# Altium schematic sheet Backflow Current Control Unit (BCCU).SchDoc
size A4; SheetNumber: 8; SheetTotal: 13
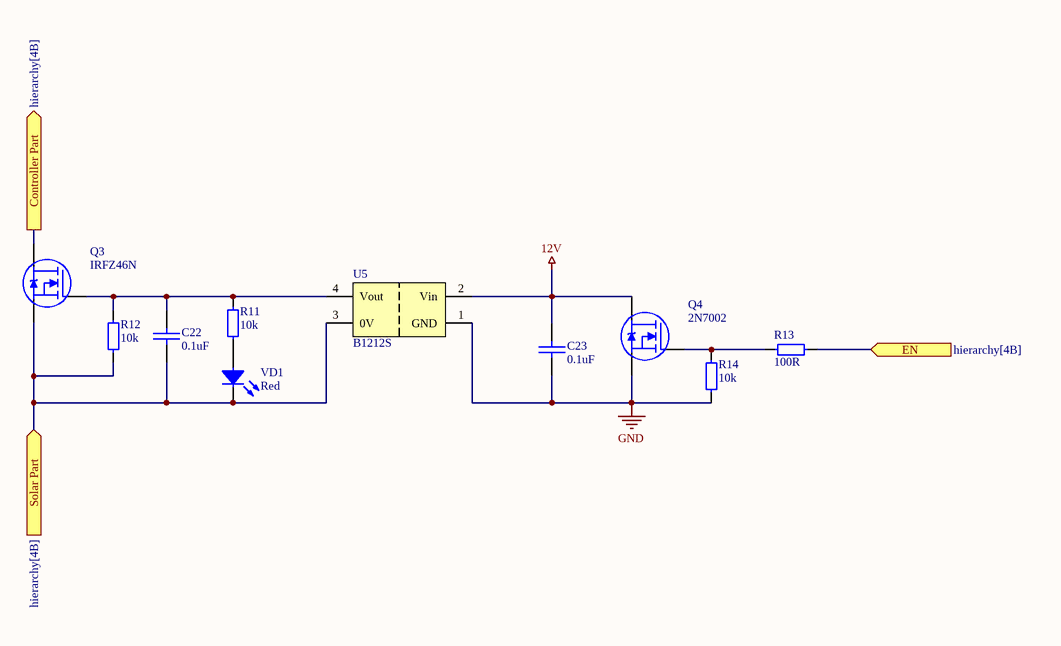
[diagram p0: Backflow Current Control Unit (BCCU).SchDoc]

## Parts
C22  0.1uF  [0805 Capicator]
C23  0.1uF  [0805 Capicator]
Q3  IRFZ46N  [TO220]
Q4  2N7002  [SOT23]
R11  10k  [0805 Resistor]
R12  10k  [0805 Resistor]
R13  100R  [0805 Resistor]
R14  10k  [0805 Resistor]
U5  B1212S  [SIP4]
VD1  Red  [LED: 0805R]

## Ports
Controller Part (out, see hierarchy[4B]), EN (in, see hierarchy[4B]), Solar Part (in, see hierarchy[4B])

## Nets
12V: C23.1 Q4.3(Drain) U5.2(Vin)
GND: C23.2 Q4.2(Source) R14.1 U5.1(GND)
Controller Part: Q3.2(Drain) ; port Controller Part
EN: R13.2 ; port EN
Solar Part: C22.1 Q3.3(Source) R12.2 U5.3(0V) VD1.2 ; port Solar Part
NetC22_2: C22.2 Q3.1(Gate) R11.1 R12.1 U5.4(Vout)
NetQ4_1: Q4.1(Gate) R13.1 R14.2
NetR11_2: R11.2 VD1.1

## Library data of the parts
C22 C23 = Cap 0.1uF (0805): 0.1uF X7R 25V 10% 0805; Manufacturer: Murata Manufacturing; Part Number: GRM21BR71E104KA01L; Type: Capacitor; ComponentLink1Description: Chip&Dip; ComponentLink1URL: https://www.chipdip.ru/product/grm21br71e104ka01l
Q3 = MOSFET-N IRFZ46N: MOSFT 55V 46A 16.5mOhm 48nC; ComponentLink1Description: Buy; ComponentLink1URL: https://radioremont.com/product/tranzistor-irfz46n-k900-11/#/discount-tab/; ComponentLink2Description: Datasheet; ComponentLink2URL: https://www.quartz1.com/price/PIC/415N0072900.pdf
Q4 = MOSFET-N 2N7002: MOSFET-N 60V 0.3A 2Ohm; Type: Transistor; ComponentLink1Description: Buy; ComponentLink1URL: https://radioremont.com/product/tranzistor-2n7002-702-k14-11/#/discount-tab/; ComponentLink2Description: Datasheet; ComponentLink2URL: https://assets.nexperia.com/documents/data-sheet/2N7002.pdf
R11 R12 R14 = Res 10k (0805): 0.125W 0805 10k, 1%; Part Number: RC0805FR-0710KL; Manufacturer: Taiwan; Type: Resistor; ComponentLink1Description: Chip&Dip; ComponentLink1URL: https://www.chipdip.ru/product0/9000079514
R13 = Res 100R (0805): 0.125W 0805 100R, 1%; Part Number: RC0805FR-07100RL; Manufacturer: Taiwan; Type: Resistor; ComponentLink1Description: Chip&Dip; ComponentLink1URL: https://www.chipdip.ru/product0/9000079462
U5 = DC/DC Isolated 12-12V B1212S-1WR3: 1W isolated DC-DC converter 12V-12V; Type: DC/DC; ComponentLink1Description: Buy; ComponentLink1URL: https://www.promelec.ru/product/464183/; ComponentLink2Description: Datasheet; ComponentLink2URL: https://www.promelec.ru/fs/sources/dc/47/05/61/9cad2af21ebdc0921eaabc53.pdf
VD1 = LED Red 0805: Type: LED; ComponentLink1Description: Buy; ComponentLink1URL: https://radioremont.com/product/svetodiod-0805-red-2v-120-mcd-r15-29/